# EAGLE schematic M1091A (EAGLE 6.6.0)
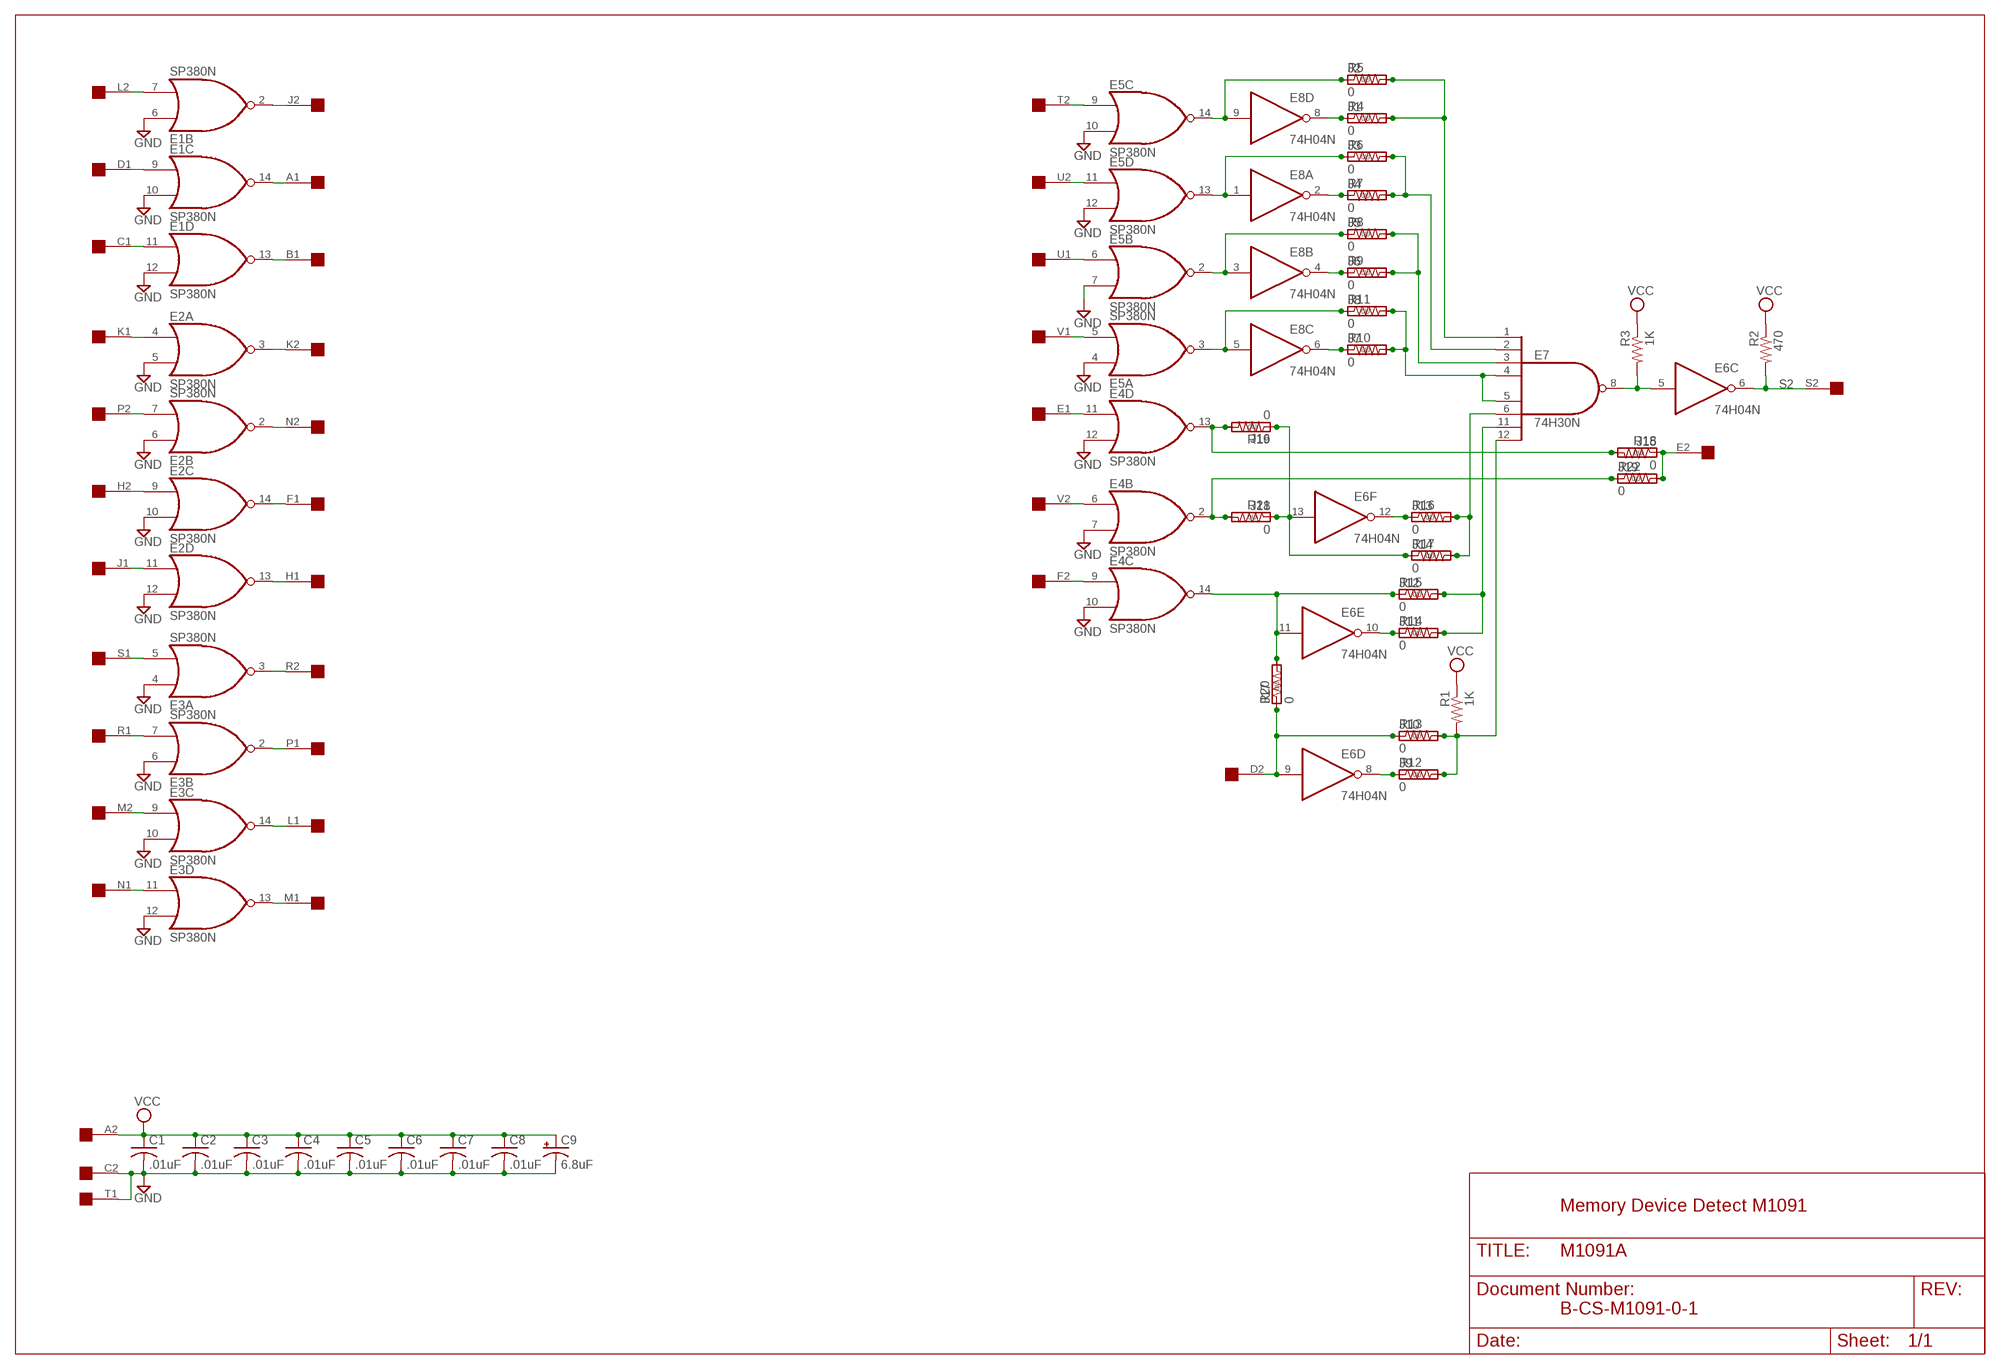
[diagram p0: schematic, sheet 1]

## Parts
C1  .01uF  C-US050-025X075  [C050-025X075]
C2  .01uF  C-US050-025X075  [C050-025X075]
C3  .01uF  C-US050-025X075  [C050-025X075]
C4  .01uF  C-US050-025X075  [C050-025X075]
C5  .01uF  C-US050-025X075  [C050-025X075]
C6  .01uF  C-US050-025X075  [C050-025X075]
C7  .01uF  C-US050-025X075  [C050-025X075]
C8  .01uF  C-US050-025X075  [C050-025X075]
C9  6.8uF  CPOL-USE20-8AXIAL  [E12-8]
E1  SP380N  [DIL14]
E2  SP380N  [DIL14]
E3  SP380N  [DIL14]
E4  SP380N  [DIL14]
E5  SP380N  [DIL14]
E6  74H04N  74S04N  [DIL14]
E7  74H30N  74S30N  [DIL14]
E8  74H04N  74S04N  [DIL14]
J1  0R  [0R/10]
J2  0R  [0R/10]
J3  0R  [0R/10]
J4  0R  [0R/10]
J5  0R  [0R/10]
J6  0R  [0R/10]
J7  0R  [0R/10]
J8  0R  [0R/10]
J9  0R  [0R/10]
J10  0R  [0R/10]
J11  0R  [0R/10]
J12  0R  [0R/10]
J13  0R  [0R/10]
J14  0R  [0R/10]
J15  0R  [0R/10]
J16  0R  [0R/10]
J17  0R  [0R/10]
J18  0R  [0R/10]
J19  0R  [0R/10]
R1  1K  R-US_0207/10  [0207/10]
R2  470  R-US_0207/10  [0207/10]
R3  1K  R-US_0207/10  [0207/10]
R4  0  R-US_0207/15  [0207/15]
R5  0  R-US_0207/15  [0207/15]
R6  0  R-US_0207/15  [0207/15]
R7  0  R-US_0207/15  [0207/15]
R8  0  R-US_0207/15  [0207/15]
R9  0  R-US_0207/15  [0207/15]
R10  0  R-US_0207/15  [0207/15]
R11  0  R-US_0207/15  [0207/15]
R12  0  R-US_0207/15  [0207/15]
R13  0  R-US_0207/15  [0207/15]
R14  0  R-US_0207/15  [0207/15]
R15  0  R-US_0207/15  [0207/15]
R16  0  R-US_0207/15  [0207/15]
R17  0  R-US_0207/15  [0207/15]
R18  0  R-US_0207/15  [0207/15]
R19  0  R-US_0207/15  [0207/15]
R20  0  R-US_0207/15  [0207/15]
R21  0  R-US_0207/15  [0207/15]
R22  0  R-US_0207/15  [0207/15]
U$2  SINGLE  [EDGE-CON2]

## Nets
A1: E1.14(C:O) U$2.A1
B1: E1.13(D:O) U$2.B1
C1: E1.11(D:I0) U$2.C1
D1: E1.9(C:I0) U$2.D1
D2: E6.9(D:I) J10.1 J17.1 R13.1 R20.1 U$2.D2
E1: E4.11(D:I0) U$2.E1
E2: J15.1 J19.2 R18.1 R22.2 U$2.E2
F1: E2.14(C:O) U$2.F1
F2: E4.9(C:I0) U$2.F2
GND [supply]: C1.2 C2.2 C3.2 C4.2 C5.2 C6.2 C7.2 C8.2 C9.- E1.6(B:I0) E1.10(C:I1) E1.12(D:I1) E2.5(A:I1) E2.6(B:I0) E2.10(C:I1) E2.12(D:I1) E3.4(A:I0) E3.6(B:I0) E3.10(C:I1) E3.12(D:I1) E4.7(B:I1) E4.10(C:I1) E4.12(D:I1) E5.4(A:I0) E5.7(B:I1) E5.10(C:I1) E5.12(D:I1) U$2.C2 U$2.T1
H1: E2.13(D:O) U$2.H1
H2: E2.9(C:I0) U$2.H2
J1: E2.11(D:I0) U$2.J1
J2: E1.2(B:O) U$2.J2
K1: E2.4(A:I0) U$2.K1
K2: E2.3(A:O) U$2.K2
L1: E3.14(C:O) U$2.L1
L2: E1.7(B:I1) U$2.L2
M1: E3.13(D:O) U$2.M1
M2: E3.9(C:I0) U$2.M2
N1: E3.11(D:I0) U$2.N1
N2: E2.2(B:O) U$2.N2
N$2: E7.12(I7) J9.2 J10.2 R1.2 R12.2 R13.2
N$4: E6.5(C:I) E7.8(O) R3.2
N$10: E7.1(I0) J1.2 J2.2 R4.2 R5.2
N$17: E8.8(D:O) J1.1 R4.1
N$18: E5.14(C:O) E8.9(D:I) J2.1 R5.1
N$45: E4.13(D:O) J15.2 J16.2 R18.2 R19.2
N$46: E4.14(C:O) E6.11(E:I) J12.1 J17.2 R15.1 R20.2
N$47: E4.2(B:O) J18.2 J19.1 R21.2 R22.1
N$56: E5.3(A:O) E8.5(C:I) J8.1 R11.1
N$57: E5.13(D:O) E8.1(A:I) J3.1 R6.1
N$59: E5.2(B:O) E8.3(B:I) J5.1 R8.1
N$68: E6.10(E:O) J11.1 R14.1
N$76: E6.8(D:O) J9.1 R12.1
N$77: E6.13(F:I) J14.1 J16.1 J18.1 R17.1 R19.1 R21.1
N$78: E6.12(F:O) J13.1 R16.1
N$82: E8.2(A:O) J4.1 R7.1
N$84: E8.4(B:O) J6.1 R9.1
N$86: E8.6(C:O) J7.1 R10.1
N$91: E7.11(I6) J11.2 J12.2 R14.2 R15.2
N$96: E7.4(I3) E7.5(I4) J7.2 J8.2 R10.2 R11.2
N$98: E7.6(I5) J13.2 J14.2 R16.2 R17.2
N$101: E7.2(I1) J3.2 J4.2 R6.2 R7.2
N$136: E7.3(I2) J5.2 J6.2 R8.2 R9.2
P1: E3.2(B:O) U$2.P1
P2: E2.7(B:I1) U$2.P2
R1: E3.7(B:I1) U$2.R1
R2: E3.3(A:O) U$2.R2
S1: E3.5(A:I1) U$2.S1
S2: E6.6(C:O) R2.2 U$2.S2
T2: E5.9(C:I0) U$2.T2
U1: E5.6(B:I0) U$2.U1
U2: E5.11(D:I0) U$2.U2
V1: E5.5(A:I1) U$2.V1
V2: E4.6(B:I0) U$2.V2
VCC [supply]: C1.1 C2.1 C3.1 C4.1 C5.1 C6.1 C7.1 C8.1 C9.+ R1.1 R2.1 R3.1 U$2.A2
Unconnected: E1.3(A:O) E1.4(A:I0) E1.5(A:I1) E4.3(A:O) E4.4(A:I0) E4.5(A:I1) E6.1(A:I) E6.2(A:O) E6.3(B:I) E6.4(B:O) E7.9 E7.10 E7.13 E8.10(E:O) E8.11(E:I) E8.12(F:O) E8.13(F:I) U$2.B2

## Notes on the sheet
- Memory Device Detect M1091
- B-CS-M1091-0-1

## Power pins joined to a net without a drawn wire
GND: E1.1(P:GND) E2.1(P:GND) E3.1(P:GND) E4.1(P:GND) E5.1(P:GND) E6.7(P:GND) E7.7(GND) E8.7(P:GND)
VCC: E1.8(P:VCC) E2.8(P:VCC) E3.8(P:VCC) E4.8(P:VCC) E5.8(P:VCC) E6.14(P:VCC) E7.14(VCC) E8.14(P:VCC)

## Library data of the parts
C1-C8 = rcl:C-US: CAPACITOR, American symbol
C9 = dec-con:CPOL-USE20-8AXIAL: A 0.8 inch electrolytic.
E1-E5 = dec-con:SP380: Quad NOR gate (use 8640)
E6 E8 = 74xx-us:74*04: Hex INVERTER
E7 = dec-con:74*30: 8-input NAND gate
J1-J19 = jumper:0R: Bridge 0R 10mm
R1-R22 = rcl:R-US_: RESISTOR, American symbol
U$2 = dec-con:SINGLE: Single-Height DEC board

## Net classes
1 supply: width 0.813 mm